# EAGLE design M4-Shim-1 (EAGLE 7.7.0)
COMPANY: ADAFRUIT INDUSTRIES; DRAWN: KTOWN; REV: B
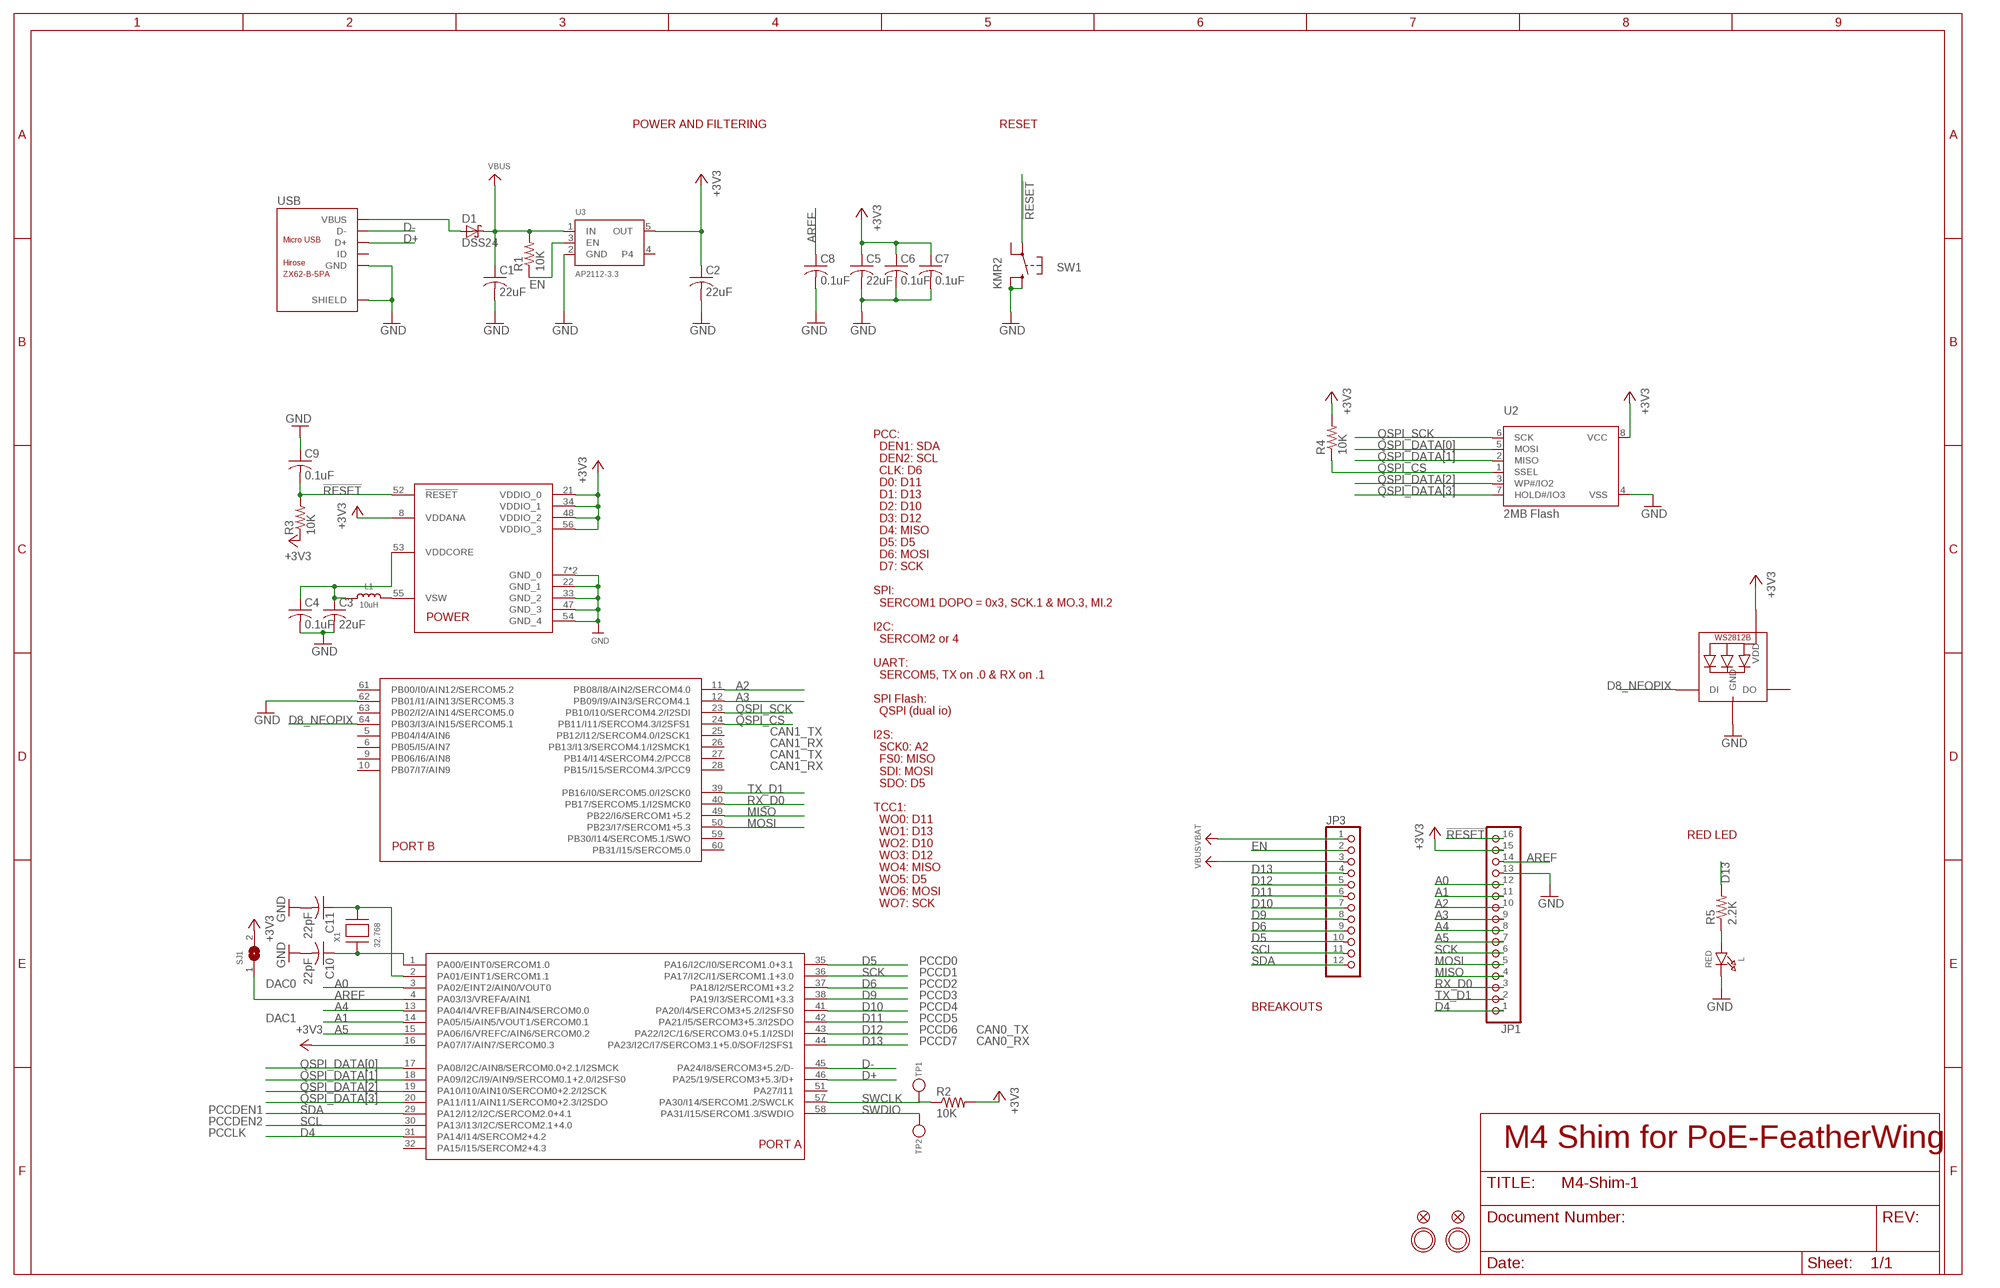
[diagram p0: schematic, sheet 1]

## Parts
C1  22uF  C-USC0805K  [C0805K]
C2  22uF  C-USC0805K  [C0805K]
C3  22uF  C-USC0805K  [C0805K]
C4  0.1uF  C-USC0402K  [C0402K]
C5  22uF  C-USC0805K  [C0805K]
C6  0.1uF  C-USC0402K  [C0402K]
C7  0.1uF  C-USC0402K  [C0402K]
C8  0.1uF  C-USC0402K  [C0402K]
C9  0.1uF  C-USC0402K  [C0402K]
C10  22pF  C-USC0402K  [C0402K]
C11  22pF  C-USC0402K  [C0402K]
D1  DSS24  [SOD123FL]
JP1  HEADER-1X16ROUND  [1X16_ROUND]
JP3  HEADER-1X12  [1X12_ROUND]
L  RED  LED0805_NOOUTLINE  [CHIPLED_0805_NOOUTLINE]
L1  10uH  INDUCTOR  [INDUCTOR_1007]
LED1  WS2812B3535  [LED3535]
R1  10K  R-US_R0402  [R0402]
R2  10K  R-US_R0402  [R0402]
R3  10K  R-US_R0402  [R0402]
R4  10K  R-US_R0402  [R0402]
R5  2.2K  R-US_R0402  [R0402]
SJ1  SOLDERJUMPERCLOSED  [SOLDERJUMPER_CLOSEDWIRE]
SW1  KMR2  SWITCH_TACT_SMT4.6X2.8  [BTN_KMR2_4.6X2.8]
TP1  TESTPOINTROUND1.5MM  [TESTPOINT_ROUND_1.5MM]
TP2  TESTPOINTROUND1.5MM  [TESTPOINT_ROUND_1.5MM]
U1  ATSAMD51J  [PQFN64-1]
U2  2MB Flash  SPIFLASH_8PINUX  [USON8]
U3  AP2112-3.3  VREG_SOT23-5  [SOT23-5]
U$31  MOUNTINGHOLE2.5  [MOUNTINGHOLE_2.5_PLATED]
U$32  MOUNTINGHOLE2.5  [MOUNTINGHOLE_2.5_PLATED]
U$34  FIDUCIAL_1MM  [FIDUCIAL_1MM]
U$35  FIDUCIAL_1MM  [FIDUCIAL_1MM]
USB  ZX62-B-5PA  MICRO-USB-SMD(ZX62-B-5PA)  [MICRO-USB5+6P-SMD-0.65-AB]
X1  32.768  XTAL-3.2X1.5  [XTAL3215]

## Nets
!RESET: C9.2 JP1.16 R3.2 SW1.A(P) U1.52(!RESET)
+3V3 [power]: C2.1 C5.1 C6.1 C7.1 JP1.15 LED1.2(VDD) R2.2 R3.1 R4.2 SJ1.2 U1.8(VDDANA) U1.16(PA07/I7/AIN7/SERCOM0.3) U1.21(VDDIO_0) U1.34(VDDIO_1) U1.48(VDDIO_2) U1.56(VDDIO_3) U2.8(VCC) U3.5(OUT)
A0: JP1.12 U1.3(PA02/EINT2/AIN0/VOUT0)
A1: JP1.11 U1.14(PA05/I5/AIN5/VOUT1/SERCOM0.1)
A2: JP1.10 U1.11(PB08/I8/AIN2/SERCOM4.0)
A3: JP1.9 U1.12(PB09/I9/AIN3/SERCOM4.1)
A4: JP1.8 U1.13(PA04/I4/VREFB/AIN4/SERCOM0.0)
A5: JP1.7 U1.15(PA06/I6/VREFC/AIN6/SERCOM0.2)
AREF: C8.1 JP1.14 SJ1.1 U1.4(PA03/I3/VREFA/AIN1)
D4: JP1.1 U1.31(PA14/I14/SERCOM2+4.2)
D5: JP3.10 U1.35(PA16/I2C/I0/SERCOM1.0+3.1)
D6: JP3.9 U1.37(PA18/I2/SERCOM1+3.2)
D8_NEOPIX: LED1.1(DI) U1.64(PB03/I3/AIN15/SERCOM5.1)
D9: JP3.8 U1.38(PA19/I3/SERCOM1+3.3)
D10: JP3.7 U1.41(PA20/I4/SERCOM3+5.2/I2SFS0)
D11: JP3.6 U1.42(PA21/I5/SERCOM3+5.3/I2SDO)
D12: JP3.5 U1.43(PA22/I2C/16/SERCOM3.0+5.1/I2SDI)
D13: JP3.4 R5.2 U1.44(PA23/I2C/I7/SERCOM3.1+5.0/SOF/I2SFS1)
D+: U1.46(PA25/19/SERCOM3+5.3/D+) USB.3(D+)
D-: U1.45(PA24/I8/SERCOM3+5.2/D-) USB.2(D-)
EN: JP3.2 R1.1 U3.3(EN)
GND [gnd]: C1.2 C2.2 C3.2 C4.2 C5.2 C6.2 C7.2 C8.2 C9.1 C10.2 C11.2 JP1.13 L.C LED1.4(GND) SW1.B'(S1) SW1.B(S) U1.7(GND_0) U1.22(GND_1) U1.33(GND_2) U1.47(GND_3) U1.54(GND_4) U1.62(PB01/I1/AIN13/SERCOM5.3) U1.EXP(GND_0) U2.4(VSS) U3.2(GND) USB.5(GND) USB.P1(SHIELD) USB.P2(SHIELD) USB.P3(SHIELD) USB.P4(SHIELD) USB.P5(SHIELD) USB.P6(SHIELD)
MISO: JP1.4 U1.49(PB22/I6/SERCOM1+5.2)
MOSI: JP1.5 U1.50(PB23/I7/SERCOM1+5.3)
N$2: L.A R5.1
N$5: C10.1 U1.1(PA00/EINT0/SERCOM1.0) X1.P$1
N$7: C11.1 U1.2(PA01/EINT1/SERCOM1.1) X1.P$2
N$11: L1.P$2 U1.55(VSW)
QSPI_CS: R4.1 U1.24(PB11/I11/SERCOM4.3/I2SFS1) U2.1(SSEL)
QSPI_DATA[0]: U1.17(PA08/I2C/AIN8/SERCOM0.0+2.1/I2SMCK) U2.5(MOSI)
QSPI_DATA[1]: U1.18(PA09/I2C/I9/AIN9/SERCOM0.1+2.0/I2SFS0) U2.2(MISO)
QSPI_DATA[2]: U1.19(PA10/I10/AIN10/SERCOM0+2.2/I2SCK) U2.3(WP#/IO2)
QSPI_DATA[3]: U1.20(PA11/I11/AIN11/SERCOM0+2.3/I2SDO) U2.7(HOLD#/IO3)
QSPI_SCK: U1.23(PB10/I10/SERCOM4.2/I2SDI) U2.6(SCK)
RX_D0: JP1.3 U1.40(PB17/SERCOM5.1/I2SMCK0)
SCK: JP1.6 U1.36(PA17/I2C/I1/SERCOM1.1+3.0)
SCL: JP3.11 U1.30(PA13/I13/I2C/SERCOM2.1+4.0)
SDA: JP3.12 U1.29(PA12/I12/I2C/SERCOM2.0+4.1)
SWCLK: R2.1 TP1.P$1 U1.57(PA30/I14/SERCOM1.2/SWCLK)
SWDIO: TP2.P$1 U1.58(PA31/I15/SERCOM1.3/SWDIO)
TX_D1: JP1.2 U1.39(PB16/I0/SERCOM5.0/I2SCK0)
VBAT [power]: JP3.1
VBUS [power]: C1.1 D1.C JP3.3 R1.2 U3.1(IN)
VBUSEXT [power]: D1.A USB.1(VBUS)
VDDCORE1: C3.1 C4.1 L1.P$1 U1.53(VDDCORE)
Unconnected: LED1.3(DO) SW1.A'(P1) U1.5(PB04/I4/AIN6) U1.6(PB05/I5/AIN7) U1.9(PB06/I6/AIN8) U1.10(PB07/I7/AIN9) U1.25(PB12/I12/SERCOM4.0/I2SCK1) U1.26(PB13/I13/SERCOM4.1/I2SMCK1) U1.27(PB14/I14/SERCOM4.2/PCC8) U1.28(PB15/I15/SERCOM4.3/PCC9) U1.32(PA15/I15/SERCOM2+4.3) U1.51(PA27/I11) U1.59(PB30/I14/SERCOM5.1/SWO) U1.60(PB31/I15/SERCOM5.0) U1.61(PB00/I0/AIN12/SERCOM5.2) U1.63(PB02/I2/AIN14/SERCOM5.0) U3.4 USB.4(ID)

## Notes on the sheet
- POWER AND FILTERING | RESET
- CAN1_TX
- CAN1_RX
- CAN1_TX
- CAN1_RX
- RED LED
- PCC:
    DEN1: SDA
    DEN2: SCL
    CLK: D6
    D0: D11
    D1: D13
    D2: D10
    D3: D12
    D4: MISO
    D5: D5
    D6: MOSI
    D7: SCK
  
  SPI:
    SERCOM1 DOPO = 0x3, SCK.1 & MO.3, MI.2
  
  I2C:
    SERCOM2 or 4
  
  UART:
    SERCOM5, TX on .0 & RX on .1
  
  SPI Flash:
    QSPI (dual io)
  
  I2S:
    SCK0: A2
    FS0: MISO
    SDI: MOSI
    SDO: D5
  
  TCC1:
    WO0: D11
    WO1: D13
    WO2: D10
    WO3: D12
    WO4: MISO
    WO5: D5
    WO6: MOSI
    WO7: SCK
- PCCD0
- PCCD1
- DAC0 | PCCD2
- PCCD3
- PCCD4 | BREAKOUTS
- DAC1 | PCCD5
- PCCD6 | CAN0_TX
- PCCD7 | CAN0_RX
- PCCDEN1
- PCCDEN2
- PCCLK
- M4 Shim for PoE-FeatherWing

## Library data of the parts
C1-C11 = rcl:C-US: CAPACITOR, American symbol
D1 = LiFePO4wered-ESP32:DSS24: DSS22-DSS225 https://datasheet.lcsc.com/szlcsc/DIYI-Elec-Tech-D24_C150988.pdf
JP1 = microbuilder:HEADER-1X16: PIN HEADER
JP3 = microbuilder:HEADER-1X12
L = microbuilder:LED: LED 0603 - 0603 Surface Mount Package 2mA: Green LED - Low Power (3.9mcd, 2ma, 1.7Vf) - Digikey: 475-2709-2-ND Orange LED - Low Power (9.8mcd, 2ma, 1.8Vf) - Digikey: 475-1194-2-ND Red LED - Low Power (5mcd, 2ma, 1.8Vf) - Digikey: 475-1195-2-ND Yellow LED - Low Power (7mcd, 2ma, 1.8Vf) - Digikey: 475-1196-2-ND 5mA: Blue LED - Low Power (17mcd, 5ma, 2.9Vf) - Digikey: LNJ937W8CRACT-ND 0805 - 0805 Surface Mount Package 2mA: Red LED (8.8mcd, 2mA, 1.8Vf, Clear) - Low Power [Digikey: 475-2510-1-ND] Green LED (5mcd, 2mA, 1.8Vf, Clear) - Low Power [Digikey: 475-2730-1-ND] Yellow LED (11.3mcd, 2mA, 1.8Vf, Clear) - Low Power [Digikey: 475-2555-1-ND] 20mA: Red LED (104mcd, 20mA, Diffused) - LS R976 [Digikey: 475-1278-6-ND] Red LED (12mcd, 20mA, 2.0Vf, Clear) - APT2012EC [Digikey: 754-1128-1-ND] Green LED (15mcd, 20mA, 2.2Vf, Clear) - APT2012GC [Digikey: 754-1131-1-ND] Orange LED (160mcd, 20mA, 2.1Vf, Clear) - APT2012SECK [Digikey: 754-1130-1-ND] 1206 - 1206 Surface Mount Package Green LED (26mcd, 20mA, Diffused) - LG N971 [Digikey: 475-1407-6-ND] Red LED (15mcd, 20mA, Diffused) - LH N974 [Digikey: 475-1416-6-ND] Cree - Cree High-Power Surface Mount LEDs XPEBWT-L1-0000-00D50 - White 111lm 350mA 2.9Vf 6200K 110° XTEAWT-00-0000-00000LEE3 - White 114lm 350mA 2.85Vf 5000K 115° Everlight - Everlight 45-21 Series Surface Mount LEDs 45-21/QK2C-B2832AC2CB2/2T - Warm White 2000mcd 20mA 3.25Vf 3050K 120° 45-21/LK2C-B38452C4CB2/2T - Nuetral White 2000mcd 20mA 3.25Vf 4150K 120° 45-21/LK2C-B50634C6CB2/2T - Cold White 2200mcd 20mA 3.25Vf 5650K 120° PLCC2 Reverse Mount LS T77K-J1L2-1-0-2-R18-Z - Red 11.25mcd 2mA 1.8Vf 630nm 120° LO T77K-L1M2-24-Z - Orange 19.6mcd 2mA 1.8Vf 606nm 120° LY T77K-K2M1-26-Z - Yellow 15.7mcd 2mA 1.8Vf 587nm 120°
L1 = microbuilder:INDUCTOR: Inductors 0603: 10nH Ceramic Inductor - microwire antenna/RF (Digikey: 712-1434-2-ND) 0805: 560nH Ceramic Inductor - RF (Digikey: 553-1047-1-ND) 270nH Ceramic Inductor - Q = 40@250MHz, +-5%, 1 Ohm DC Resistance (Digikey: 535-10506-2-ND) 1007 (2518 Metric) SMT: 10µH 10% 250mOhm 820mA 1007 Inductor (Digikey: 587-2189-1-ND) 22µH 10% 500mOhm 580mA 1007 Inductor (Digikey: 587-2190-1-ND) 47µH 10% 950mOhm 420mA 1007 Inductor (Digikey: 587-2191-1-ND) 47µH 5% 100mOhm 1A 1008 Inductor (Digikey: 732-1816-1-ND) 5.0x5.0mm (Taiyo Yuden NR5040 Series) 6.8µH 20% 2.3A 64mOhm Inductor (Digikey: 587-2374-2-ND) 5.0x5.0mm (TDK VLC5045 Series) 4.7µH 20% 3.3A 34mOhm Inductor (Digikey: 445-6526-1-ND) 6.8µH 20% 2.7A 46mOhm Inductor (Digikey: 445-6527-1-ND) 6.0x6.0mm (TDK VLC6045 Series) 4.7µH 20% 3.8A 27mOhm Inductor (Digikey: 445-6538-2-ND) 6.8µH 20% 3A 41mOhm Inductor (Digikey: 445-6540-1-ND) 6.2µH 30% 2.2A 45mOhm Inductor (Digikey: SRR5028-6R2YCT-ND) - Not TDK VLC6045 but footprint should match 6.0x6.0mm (TDK SLF6045 Series) 6.8uH 30% 2A 33mOhm Inductor (Digikey: 445-4572-1-ND, Mouser: 810-SLF645T6R8N2R0PF) 6.0x6.0mm (Sumida CDRH5D28 Series) 6.2uH 30% 1.8A 45mOhm Inductor (Digikey: 308-1542-1-ND) Taiyo Yuden NR3015T2R2M - 2.2uH 20% 1.5A (Digikey: 587-1648-2-ND, Mouser: 963-NR3015T2R2M) - Used with TI TPS62172 CoilCraft RFID Transponder Coil - MA5532-AE (For use with AS3935 Lightning Sensor) Taiyo Yuden NRH2412T2R2MNGH - 2.2uH 20% 1AA (Digikey: 587-3443-1-ND) - Used with TI LM3671 Vishay IHLP 1.0uH Molded Inductor - 24mOhm DCR, 5A, +/-20%, -55°C-125°C (Digikey: 541-1319-1-ND)
LED1 = microbuilder:WS2812B
R1-R5 = rcl:R-US_: RESISTOR, American symbol
SJ1 = microbuilder:SOLDERJUMPER: SMD Solder JUMPER Solder the two pads together to create a connection, or remove the solder to break it. REFLOW - Use this footprint for solder paste and reflow ovens. WAVE - Use this footprint for hand-soldering (larger pads). CLOSED - Has a trace between the two pads to ensure it is closed by default. The trace needs to be cut to disable the jumper, and can be closed again by creating a solder bridge between the two pads.
SW1 = microbuilder:SWITCH_TACT_SMT: SMT Tact Switches 6x6mm - Digikey: P12940SCT-ND KMR2 (4.6x2.8mm) - Digikey: 401-1426-1-ND EVQ-PQHB55 - Light Touch, 160GF (4.5x4.5mm) - Digikey: P8090SCT-ND KMT0 - KMT021 NGJ LHS (etc.) IP68/Waterproof - Digikey: CKN10289CT-ND
TP1 TP2 = microbuilder:TESTPOINT: Test Point Various test points for characterisation and PCB testing TESTPOINT_SMT - Compact Surface Mount Test Point [Digikey: 5016KTR-ND]
U1 = microbuilder:ATSAMD51J: ATSAMD51J cortex m4 microcontroller
U2 = microbuilder:SPIFLASH_8PIN: SOIC8 SPI Flash Be careful with the size since SOIC8 flash comes in several 'widths' SOIC8 150 mil M25P16 - 16Mbit (2Mbit x 8) Serial Flash (75MHz SPI Bus), Supply: 2.7-3.6V Digikey: SOIC8 - M25P16-VMN6P-ND SOIC8 208 mil W25Q16BVSSIG - 16Mbit (2Mbit x 8) Serial Flash (104MHz SPI Bus), Supply: 2.7-3.6V Digikey: SOIC8 - W25Q16BVSSIG-ND
U3 = microbuilder:VREG_SOT23-5: SOT23-5 Fixed Voltage Regulators Part Current Out V Out V In V Dropout θJA (°C/W) TJ (°C) Digikey Part No. ADP121 150mA 3.3V 3.4-5.5V 0.09V @ 150mA -- -- ADP121-AUJZ33R7CT-ND ADP121 150mA 3.0V 3.1-5.5V 0.09V @ 150mA -- -- ADP121-AUJZ30R7CT-ND ADP122 300mA 3.3V 3.4-5.5V 0.085V @ 300mA -- -- ADP122AUJZ-3.3-R7CT-ND ADP1712 300mA 3.3V 3.5-5.5V 0.17V @ 300mA -- -- ADP1712AUJZ-3.3-R7TR-ND AP7311 (Low Cost) 150mA 3.3V 3.5-6V 0.15V @ 150mA -- -- AP7311-33WG-7DICT-ND LD39015M18R 150mA 1.8V 1.9V-5.5V 0.08V @ 100mA -- -- 497-6977-1-ND LP2985A-33DBVR 150mA 3.3V 3.3-16V 0.28V @ 150mA 206 150 296-18479-1-ND MCP1824T-3302E/OT 300mA 3.3V 3.5V-6V 0.2V @ 300mA -- -- MCP1824T-3302E/OTCT-ND MIC5205-2.5YM5 TR 150mA 2.5V 2.7-16V 0.165V @ 150mA -- -- 576-1257-2-ND MIC5205-3.0YM5 TR 150mA 3.0V 3.2V-16V 0.165V @ 150mA -- -- 576-1258-2-ND MIC5205-3.3YM5 TR 150mA 3.3V 3.5V-16V 0.165V @ 150mA -- -- 576-1259-2-ND TPS780330220 150mA 3.3V+2.2V 3.6-5.5V 250mV Max -- -- 296-23332-1-ND TDA3663/N1,135 100mA 3.3V 3.5-45V 0.18V @ 50mA -- -- 568-5343-1-ND Max operating temp can be calculated using θJA, TJ (max junction temperature), and power in watts. Set the "Maximum Ambient Temperature" until it reaches TJ ("Max Junction Temperature"), which is the absolute limit for safe use of the regulator: Heat Sink Temperature Calculator <http://www.daycounter.com/Calculators/Heat-Sink-Temperature-Calculator.phtml> For example, With 12V source into a 3.3V LP2985 and a 30mA load, we are dissipating (12V-3.3V) * 0.03A = 0.261W. With a θJA of 206 °C/W, a TJ of 150°C, and 261mW we can safely use the chip without a heat sink up to 75°C (=147.1°C Junction Temperature).
U$31 U$32 = microbuilder:MOUNTINGHOLE: Mounting Hole For #2 screws (0.086"/2.18mm width, 0.094"/2.4mm hole) use 2.5mm; BOM: EXCLUDE
U$34 U$35 = microbuilder:FIDUCIAL: Fiducial Alignment Points Various fiducial points for machine vision alignment.; BOM: EXCLUDE
USB = Seeed-OPL-Connector:MICRO-USB-SMD(ZX62-B-5PA): 320010005; MPN: ZX62-B-5PA
X1 = adafruit2:XTAL: Low cost SMT crystals, no capacitors included http://www.ladyada.net/library/eagle

## Net classes
1 power: width 0.305 mm
2 gnd: width 0.254 mm

## Board
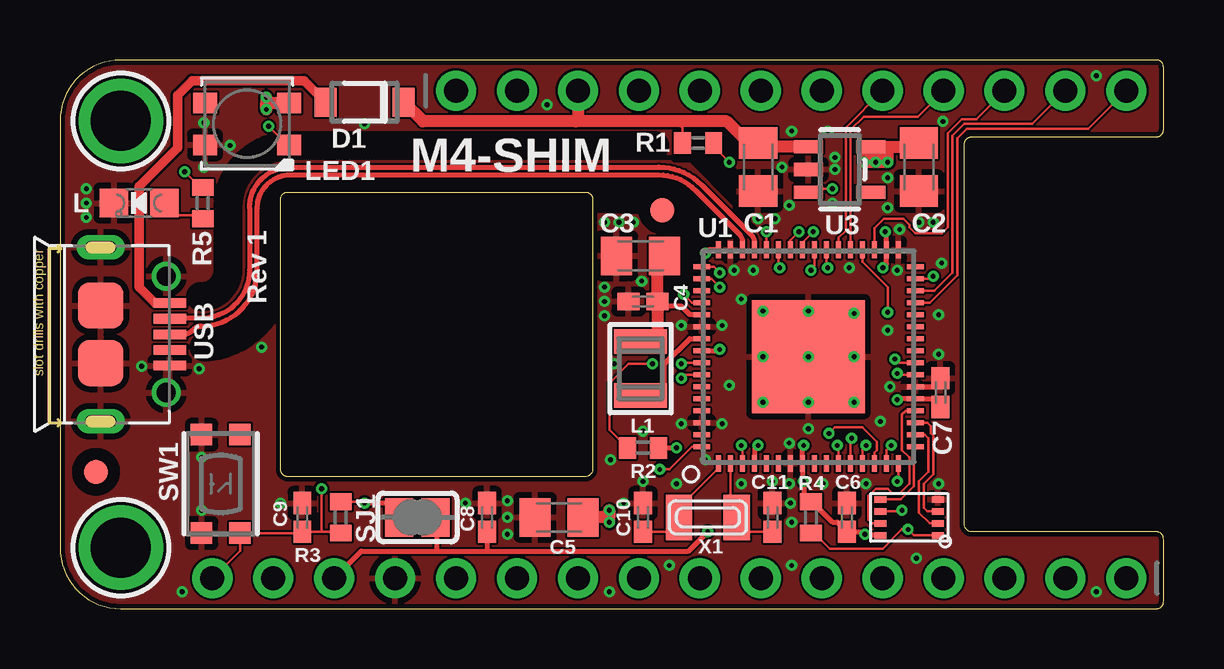
[diagram p1: board, top side]
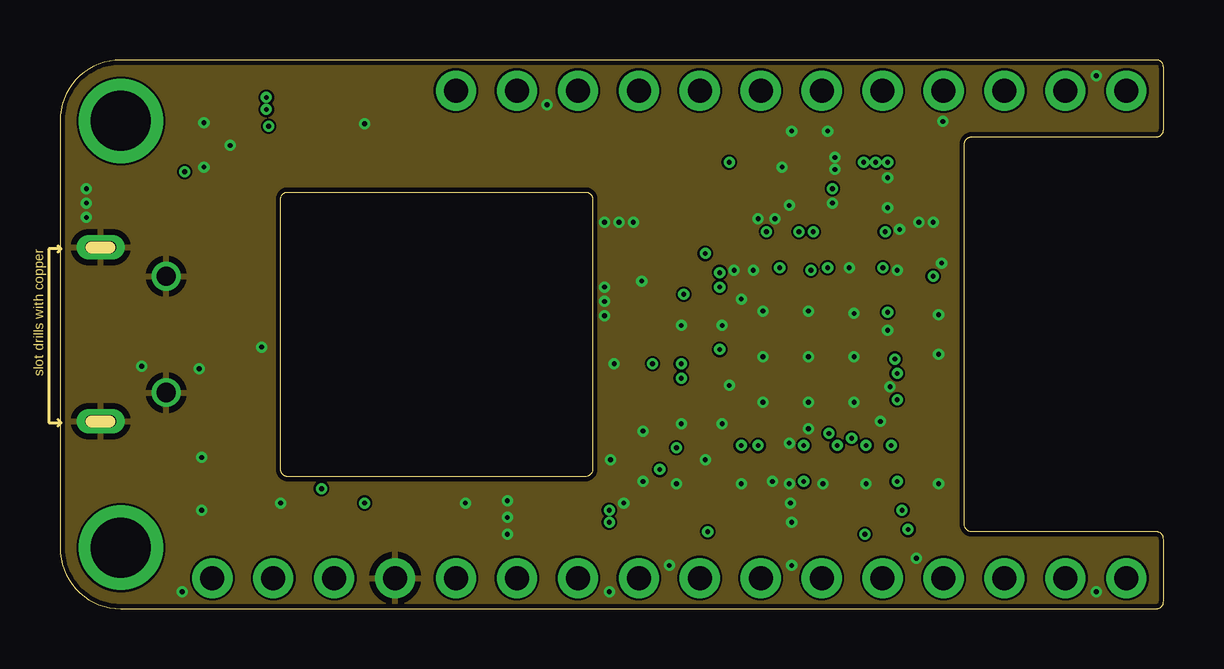
[diagram p2: board, inner layer Route2]
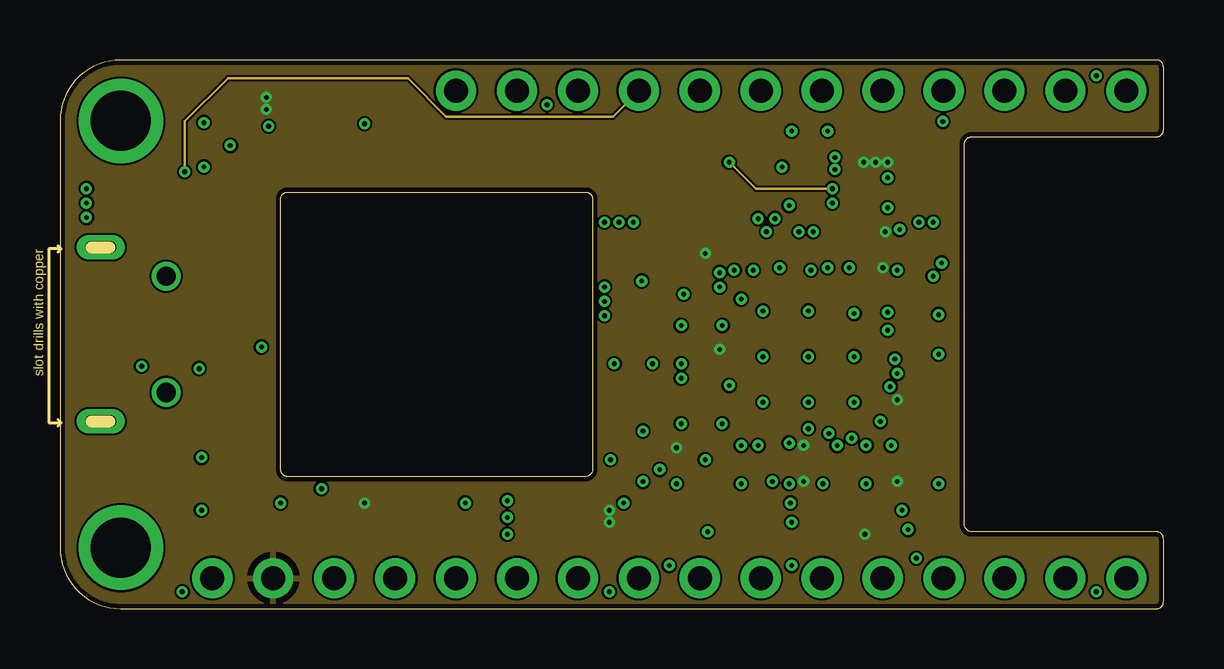
[diagram p3: board, inner layer Route3]
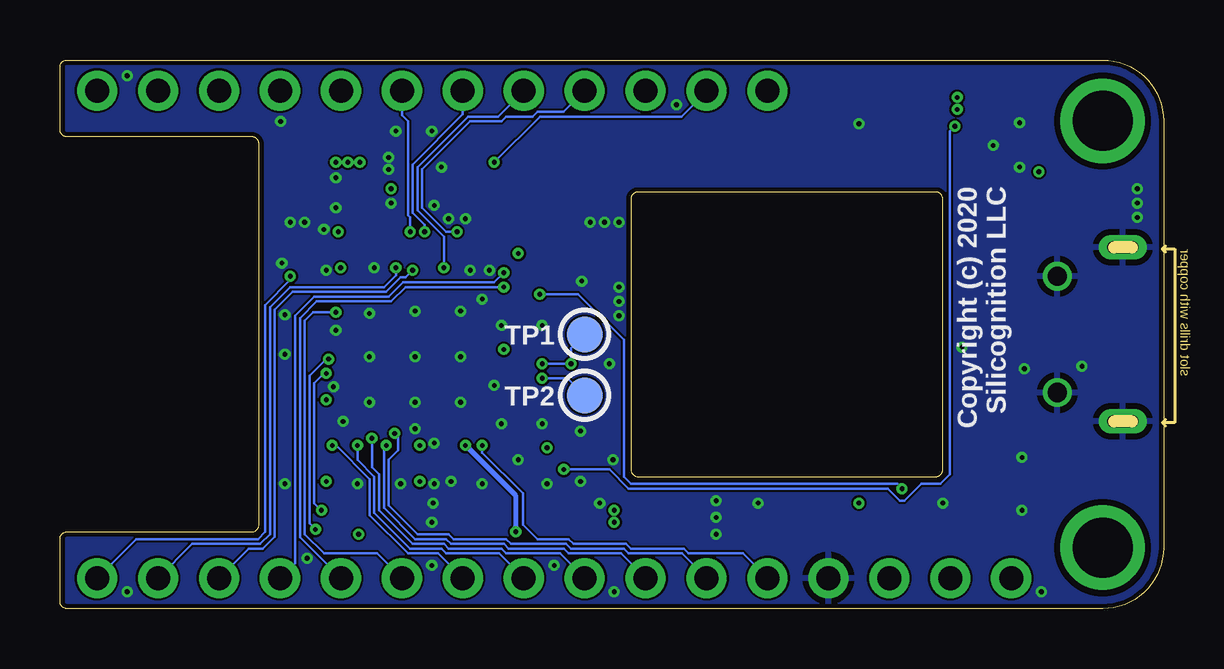
[diagram p4: board, bottom side, seen from below]

Size 46 x 22.86 mm. Coordinates in mm from the lower left corner, seen from the top.
Outline: 45.7,22.86 2.54,22.86 arc90 0,20.32 0,2.54 arc90 2.54,0 45.7,0 arc90 46,0.3 46,2.9 arc90 45.7,3.2 38,3.2 arc-90 37.7,3.5 37.7,19.36 arc-90 38,19.66 45.7,19.66 arc90 46,19.96 46,22.56 arc90 45.7,22.86
Outline: 21.9,5.5 9.5,5.5 arc-90 9.2,5.8 9.2,17.06 arc-90 9.5,17.36 21.9,17.36 arc-90 22.2,17.06 22.2,5.8 arc-90 21.9,5.5
Copper layers (1+2*3+16): Top 0.035mm / dielectric 0.24mm / Route2 0.017mm / dielectric 1mm / Route3 0.017mm / dielectric 0.24mm / Bottom 0.035mm
Design rules "default-4-layer": minimum track width 3.5mil, minimum drill 0.2mm, track to track 3.5mil, track to pad 5mil, pad to pad 5mil, via to via 5mil, smd to smd 3.5mil, copper to edge 0.2mm, drill to drill 0.1mm, minimum pad ring 3mil, minimum via ring 0.13mm, stop-mask expansion 4mil, vias tented up to drill 20mil, thermal gap 10mil
tRestrict: 19 lines

### Footprints (pad centres in the part's own frame; a part is rotated, then mirrored left to right if it is on the bottom)
C0805K = smd 1.3 x 1.6: 1 -1,0; 2 1,0
C0402K = smd 0.925 x 0.74: 1 -0.6,0; 2 0.6,0
SOD123FL = smd 0.91 x 1.22: A 1.625,0; C -1.625,0
1X16_ROUND = drill 1 pad 1.676: 1 -19.05,0; 2 -16.51,0; 3 -13.97,0; 4 -11.43,0; 5 -8.89,0; 6 -6.35,0; 7 -3.81,0; 8 -1.27,0; 9 1.27,0; 10 3.81,0; 11 6.35,0; 12 8.89,0; 13 11.43,0; 14 13.97,0; 15 16.51,0; 16 19.05,0
1X12_ROUND = drill 1 pad 1.676: 1 -13.97,0; 2 -11.43,0; 3 -8.89,0; 4 -6.35,0; 5 -3.81,0; 6 -1.27,0; 7 1.27,0; 8 3.81,0; 9 6.35,0; 10 8.89,0; 11 11.43,0; 12 13.97,0
CHIPLED_0805_NOOUTLINE = smd 1.2 x 1.2: A 0,-1.05; C 0,1.05
INDUCTOR_1007 = smd 1.016 x 2.2: P$1 -1.127,0; P$2 1.127,0
LED3535 = smd 1 x 0.85: 1 -1.75,0.875; 2 -1.75,-0.875; 3 1.75,-0.875; 4 1.75,0.875
R0402 = smd 0.7 x 0.9: 1 -0.65,0; 2 0.65,0
SOLDERJUMPER_CLOSEDWIRE = smd 1.168 x 1.6: 1 -0.762,0; 2 0.762,0 | smd 0.635 x 0.203: WIRE 0,0
BTN_KMR2_4.6X2.8 = smd 0.9 x 0.9: A 2.05,0.8; A' -2.05,0.8; B 2.05,-0.8; B' -2.05,-0.8
TESTPOINT_ROUND_1.5MM = smd 1.5 x 1.5: P$1 0,0
PQFN64-1 = smd 0.7 x 0.22: 1 -4.45,3.75; 2 -4.45,3.25; 3 -4.45,2.75; 4 -4.45,2.25; 5 -4.45,1.75; 6 -4.45,1.25; 7 -4.45,0.75; 8 -4.45,0.25; 9 -4.45,-0.25; 10 -4.45,-0.75; 11 -4.45,-1.25; 12 -4.45,-1.75; 13 -4.45,-2.25; 14 -4.45,-2.75; 15 -4.45,-3.25; 16 -4.45,-3.75; 33 4.45,-3.75; 34 4.45,-3.25; 35 4.45,-2.75; 36 4.45,-2.25; 37 4.45,-1.75; 38 4.45,-1.25; 39 4.45,-0.75; 40 4.45,-0.25; 41 4.45,0.25; 42 4.45,0.75; 43 4.45,1.25; 44 4.45,1.75; 45 4.45,2.25; 46 4.45,2.75; 47 4.45,3.25; 48 4.45,3.75 | smd 0.22 x 0.7: 17 -3.75,-4.45; 18 -3.25,-4.45; 19 -2.75,-4.45; 20 -2.25,-4.45; 21 -1.75,-4.45; 22 -1.25,-4.45; 23 -0.75,-4.45; 24 -0.25,-4.45; 25 0.25,-4.45; 26 0.75,-4.45; 27 1.25,-4.45; 28 1.75,-4.45; 29 2.25,-4.45; 30 2.75,-4.45; 31 3.25,-4.45; 32 3.75,-4.45; 49 3.75,4.45; 50 3.25,4.45; 51 2.75,4.45; 52 2.25,4.45; 53 1.75,4.45; 54 1.25,4.45; 55 0.75,4.45; 56 0.25,4.45; 57 -0.25,4.45; 58 -0.75,4.45; 59 -1.25,4.45; 60 -1.75,4.45; 61 -2.25,4.45; 62 -2.75,4.45; 63 -3.25,4.45; 64 -3.75,4.45 | smd 4.7 x 4.7: EXP 0,0
USON8 = smd 0.5 x 0.275: 1 -1.2,0.75; 2 -1.2,0.25; 3 -1.2,-0.25; 4 -1.2,-0.75; 5 1.2,-0.75; 6 1.2,-0.25; 7 1.2,0.25; 8 1.2,0.75
SOT23-5 = smd 0.55 x 1.2: 1 -0.95,-1.3; 2 0,-1.3; 3 0.95,-1.3; 4 0.95,1.3; 5 -0.95,1.3
MOUNTINGHOLE_2.5_PLATED = drill 2.5 pad 3.2: P$1 0,0
FIDUCIAL_1MM = smd 1 x 1: 1 0,0
MICRO-USB5+6P-SMD-0.65-AB = smd 0.4 x 1.35: 1 -1.3,2.875; 2 -0.65,2.875; 3 0,2.875; 4 0.65,2.875; 5 1.3,2.875 | smd 1.9 x 1.9: P1 -1.2,0; P2 1.2,0 | drill 0.508 pad 1.016 long: P3 -3.625,0; P4 3.625,0 | drill 0.8: P5 -2.425,2.73; P6 2.425,2.73
XTAL3215 = smd 1.1 x 1.9: P$1 1.2,0; P$2 -1.2,0

### Placement (x,y rotation side)
C1  29.1,18.4 270 top
C2  35.8,18.4 270 top
C3  24.2,14.7 180 top
C4  24.3,12.8 180 top
C5  20.8,3.8 180 top
C6  32.8,3.8 90 top
C7  36.7,9 90 top
C8  17.8,3.8 90 top
C9  10.1,3.8 270 top
C10  24.3,3.8 90 top
C11  29.7,3.8 90 top
D1  12.7,21.1 180 top
JP1  25.4,1.27 180 top
JP3  30.48,21.58 0 top
L  3.3,16.9 90 top
L1  24.2,10 270 top
LED1  7.8,20.2 180 top
R1  26.6,19.4 180 top
R2  24.3,6.7 0 top
R3  11.7,3.8 270 top
R4  31.3,3.8 90 top
R5  5.95,16.9 90 top
SJ1  14.9,3.8 180 top
SW1  6.7,5.2 270 top
TP1  24.13,11.43 0 bottom
TP2  24.13,8.89 0 bottom
U1  31.2,10.5 90 top
U2  35.4,3.8 180 top
U3  32.5,18.3 270 top
U$31  2.54,20.32 0 top
U$32  2.54,2.54 0 top
U$34  25.11,16.6 0 top
U$35  1.5,5.7 0 top
USB  1.7,11.43 270 top
X1  27,3.8 180 top

### Tracks (layer width: path | path; a pad name or v marks a point on that pad's centre or on a via)
!RESET  (via drill 0.2)
  Top 0.1: JP1.16 7.5,2.42 SW1.A 10.05,3.15 C9.2 10.9,3.2 | 10.9,3.2 11.65,3.2 R3.2 | U1.52 26.35,12.75 v26,13.1 | v10.9,5 10.9,3.2
  Bottom 0.1: v26,13.1 24.4,13.1 22.5,11.2 22.5,5.5 22.2,5.2 11.1,5.2 v10.9,5
+3V3  (via drill 0.2)
  Top 0.1: v34.9,5.3 34.95,5.35 U1.16 | R3.1 12.65,4.45 v12.7,4.4
  Top 0.2: v34.9,8.7 34.95,8.75 U1.21 36.35,8.75 C7.1 | v31,6.8 30.95,6.75 U1.8 30.95,5.35 v31,5.3 31,4.6 31.2,4.6 31.3,4.5 | U1.56 27.45,10.75 v27.5,10.8 | R2.2 v25.7,6.7 | v34.3,14.2 34.45,14.35 U1.34 34.45,15.65 v34.4,15.7 | U2.8 33.6,3.05 v33.55,3.1 33.45,3.2 C6.1 32.4,3.6 32.2,3.6 31.35,4.45 R4.2 | SJ1.2 14.14,3.86 13.6,4.4 v12.7,4.4 | U1.48 27.05,14.95 v26.9,14.8
  Top 0.5: C2.1 35.65,19.25 U3.5 34,19.05 v34,18.6 | 33.5,19.2 v33.5,18.6 v34.5,18.6 34.5,19.2 | v8.6,21.3 v8.6,20.8 8.6,21.07 LED1.2 | v22.9,3.6 22.9,3.8 | v22.9,4.1 22.9,3.8 | 22.9,3.8 C5.1
  pour Route3: 0,0 46,0 46,22.9 0,22.9
A0  (via drill 0.2)
  Top 0.1: U1.3 28.45,6.75 v28.4,6.8
  Bottom 0.1: v28.4,6.8 28.4,6.5 26.7,4.8 26.7,3.5 26.1,2.9 24.8,2.9 24.6,2.7 22.4,2.7 22.2,2.5 20,2.5 19.8,2.3 17.54,2.3 JP1.12
A1  (via drill 0.2)
  Top 0.1: U1.14 33.95,6.5 34.05,6.6 34.05,6.95 33.45,7.55 32.3,7.55 v32.05,7.3
  Bottom 0.1: v32.05,7.3 31.9,7.15 31.9,6.6 32.3,6.2 32.3,4.3 31.1,3.1 29.8,3.1 29.6,2.9 27.4,2.9 27.2,2.7 24.9,2.7 24.7,2.5 22.5,2.5 22.3,2.3 20.08,2.3 JP1.11
A2  (via drill 0.2)
  Top 0.1: U1.11 32.45,6.65 v32.4,6.8
  Bottom 0.1: v32.4,6.8 32.5,6.7 32.5,4.2 31.2,2.9 29.9,2.9 29.7,2.7 27.5,2.7 27.3,2.5 25,2.5 24.8,2.3 22.62,2.3 JP1.10
A3  (via drill 0.2)
  Top 0.1: U1.12 32.95,7.05 v33,7.1
  Bottom 0.1: v33,7.1 33,5.9 32.7,5.6 32.7,4.1 31.3,2.7 30,2.7 29.8,2.5 27.6,2.5 27.4,2.3 25.16,2.3 JP1.9
A4  (via drill 0.2)
  Top 0.1: U1.13 33.45,6.65 v33.6,6.8
  Bottom 0.1: JP1.8 27.7,2.3 29.9,2.3 30.1,2.5 31.4,2.5 32.9,4 32.9,5.5 33.6,6.2 v33.6,6.8
A5  (via drill 0.2)
  Top 0.1: U1.15 34.45,6.6 v34.65,6.8
  Bottom 0.1: v34.65,6.8 34.5,6.8 33.1,5.4 33.1,3.9 31.5,2.3 30.24,2.3 JP1.7
AREF  (via drill 0.2)
  Top 0.2: JP1.14 12.56,2.4 15.7,2.4 | 15.7,2.4 17.8,2.4 | 17.8,2.4 26.2,2.4 v27,3.2 | C8.1 17.8,2.4 | SJ1.1 15.7,3.76 15.7,2.4 | v29.1,6.8 28.95,6.65 U1.4
  Bottom 0.2: v27,3.2 27,4.7 v29.1,6.8
D4  (via drill 0.2)
  Top 0.1: U1.31 36.3,13.75 v36.4,13.85
  Bottom 0.1: JP1.1 42.82,2.9 37.75,2.9 37.45,3.2 37.45,12.65 36.4,13.7 v36.4,13.85
D5
  Top 0.1: U1.35 33.95,15.85 34.35,16.25 35.15,16.25 35.4,16 35.4,15.9 35.65,15.65 36.75,15.65 37,15.9 37,19.8 37.6,20.4 38.19,20.4 JP3.10
D6
  Top 0.1: U1.37 32.95,19.95 33.5,20.5 35.75,20.5 JP3.9
D8_NEOPIX  (via drill 0.2)
  Top 0.1: LED1.1 9.47,19.32 v8.7,20.1 | U1.64 26.35,6.75 25.4,5.8 v25,5.8
  Bottom 0.1: v8.7,20.1 8.9,19.9 8.9,5.6 9.3,5.2 10.1,5.2 10.8,4.5 11,4.5 11.5,5 22.3,5 23.1,5.8 v25,5.8
D9
  Top 0.1: U1.38 32.45,15.45 32.75,15.75 32.75,20.04 JP3.8
D10  (via drill 0.2)
  Top 0.1: U1.41 30.95,15.25 v31.4,15.7
  Bottom 0.1: v31.4,15.7 31.4,16.3 31.5,16.4 31.5,20.3 31.75,20.55 JP3.7
D11  (via drill 0.2)
  Top 0.1: U1.42 30.45,15.35 v30.8,15.7
  Bottom 0.1: JP3.6 29.21,20.59 31.3,18.5 31.3,16.5 30.8,16 v30.8,15.7
D12  (via drill 0.2)
  Top 0.1: U1.43 29.95,14.25 v30,14.2
  Bottom 0.1: v30,14.2 30,15.5 31.1,16.6 31.1,18.4 29,20.5 27.75,20.5 JP3.5
D13  (via drill 0.2)
  Top 0.1: v5.2,18.2 5.85,17.55 R5.2 | U1.44 v29.45,15.7
  Route3 0.1: JP3.4 23.05,20.5 16.1,20.5 14.5,22.1 7,22.1 5.2,20.3 v5.2,18.2
  Bottom 0.1: JP3.4 25.01,20.7 26.1,20.7 26.3,20.5 27.4,20.5 27.6,20.3 28.9,20.3 30.9,18.3 30.9,16.7 29.9,15.7 v29.45,15.7
D+
  Top 0.2: 28.45,15.35 U1.46 28.45,15.27 arc45 28.3,15.62 26.49,17.44 arc45 24.95,18.07 9.6,18.07 arc90 8.22,16.7 8.22,14.1 arc-90 5.9,11.78 arc45 5.56,11.63 5.5,11.58 arc-45 5.15,11.43 USB.3
D-
  Top 0.2: 4.59,12.1 5.9,12.1 arc90 7.9,14.1 7.9,16.7 arc-90 9.6,18.4 24.96,18.4 arc-45 26.73,17.67 28.8,15.6 arc-45 28.95,15.24 U1.45
  Top 0.35: 4.59,12.1 USB.2
EN  (via drill 0.2)
  Top 0.1: R1.1 27.5,19.15 27.5,19 v27.9,18.6 | U3.3 31.35,17.5 v32.2,17.5
  Route3 0.1: v27.9,18.6 29,17.5 v32.2,17.5
  Bottom 0.1: v27.9,18.6 26,20.5 20.1,20.5 19.05,21.55 JP3.2
GND  (via drill 0.2, 0.5)
  Top 0.2: U1.22 36.35,9.25 C7.2
  other vias: 9.2,4.4 22.7,13.4 22.7,12.8 22.7,12.2 23.3,16.1 22.7,16.1 23.9,16.1 24.25,13.65 25.9,11.8 27.6,11.8 30.4,6.9 30.4,5.2 28.1,14.1 35,15.8 34.9,14.1 34.6,9.25 36.62,10.6 36.62,5.2 34.5,17.95 34.5,16.7 32.3,18.3 35.8,16.1 29.3,12.4 33.1,12.3 29.3,8.6 33.1,8.6 29.3,10.5 33.1,10.5 31.2,12.4 31.2,10.5 31.2,8.6 7.1,19.3 6,20.25 6,18.4 1.1,16.9 1.1,17.5 1.1,16.3 30.1,18.4 30.4,16.8 5.8,10 3.4,10.1 29.1,16.25 29.8,16.25 36.4,16.1 31.8,5.2 33.6,5.2 5.9,6.3 5.9,4.1 23.1,10.2 16.9,4.4 18.65,3.8 18.65,4.5 18.65,3.1 24.3,7.4 25.9,7.7 27.6,7.7 32.2,16.9 32.3,18.8 30.45,4.4 29.7,5.3 28.4,5.2 25.7,5.2 24.3,5.3 23.5,4.4 36.62,12.25 36.75,14.4 30.5,19.9 36.8,20.3 32,19.9 28.9,14.1 28.4,12.9 32.9,14.2 34.5,11.6 34.2,7.8 31.2,7.5 27.9,9.3 26.9,6.2 22.95,6.2 30.5,3.6 12.7,20.2 20.3,21 43.2,22.2 5.1,0.7 22.9,0.7 43.2,0.7 35.7,2.1 30.5,1.8 25.4,1.8 8.4,10.9 1.7,15.05 1.7,7.8 1.8,7.8 1.9,7.8 2,7.8 2.1,7.8 1.6,7.8 1.5,7.8 1.4,7.8 1.3,7.8 1.8,15.05 1.9,15.05 2,15.05 2.1,15.05 1.6,15.05 1.5,15.05 1.4,15.05 1.4,15.05 1.3,15.05
  pour Top: 0,0 46,0 46,22.9 0,22.9
  pour Route2: 0,0 46,0 46,22.9 0,22.9
  pour Bottom: 0,0 46,0 46,22.9 0,22.9
MISO  (via drill 0.2)
  Top 0.1: v27.5,14 27.25,14.25 U1.49
  Bottom 0.1: JP1.4 36.2,1.9 36.2,12.2 35.4,13 32.3,13 31.7,13.6 27.9,13.6 v27.5,14
MOSI  (via drill 0.2)
  Top 0.1: v27.5,13.4 27.15,13.75 U1.50
  Bottom 0.1: JP1.5 36,2.98 36,12.1 35.3,12.8 32.2,12.8 31.6,13.4 v27.5,13.4
N$2
  Top 0.1: R5.1 5.8,16.4 4.8,16.4 4.35,16.85 L.A
N$5
  Top 0.1: X1.P$1 25.8,4.2 25.95,4.35 | 25.95,4.35 27.45,5.85 U1.1 | C10.1 25.95,3.2 25.95,4.35
N$7
  Top 0.1: U1.2 27.95,4.05 X1.P$2 28.2,3.2 C11.1
N$11
  Top 0.2: L1.P$2 24.87,8.87 25.2,9.2 25.2,10.2 26.25,11.25 U1.55
QSPI_CS  (via drill 0.2)
  Top 0.1: U2.1 35.6,3.05 v35.35,3.3 35.1,3.3 34.3,2.5 32.1,2.5 31.7,2.9 31.55,2.9 R4.1 | v34.8,10.4 34.95,10.25 U1.24
  Bottom 0.1: v35.35,3.3 35.6,3.55 35.6,9.7 34.9,10.4 v34.8,10.4
QSPI_DATA[0]
  Top 0.1: U2.5 35.05,4.55 35.6,5.1 35.6,6.7 U1.17
QSPI_DATA[1]
  Top 0.1: U1.18 36.05,7.25 36.2,7.1 36.2,5.7 35.8,5.3 35.8,4 36.25,3.55 U2.2
QSPI_DATA[2]
  Top 0.1: U1.19 36.15,7.75 36.3,7.6 36.3,7.3 36.4,7.2 36.4,5.6 36,5.2 36,4.2 36.15,4.05 U2.3
QSPI_DATA[3]
  Top 0.1: U1.20 35.25,8.25 35.1,8.1 35.1,6.6 35.4,6.3 35.4,5.2 35,4.8 34.7,4.8 34.5,5 34,5 33.7,4.7 33.7,3.7 33.85,3.55 U2.7
QSPI_SCK  (via drill 0.2)
  Top 0.1: U2.6 35.05,4.05 v35.1,4.1 | v34.9,9.8 34.95,9.75 U1.23
  Bottom 0.1: v35.1,4.1 35.4,4.4 35.4,9.4 35,9.8 v34.9,9.8
RX_D0  (via drill 0.2)
  Top 0.1: v31.3,14.1 31.45,14.25 U1.40
  Bottom 0.1: JP1.3 38.14,2.5 37.55,2.5 37.05,3 37.05,12.45 36.3,13.2 32.4,13.2 31.8,13.8 31.6,13.8 v31.3,14.1
SCK  (via drill 0.2)
  Top 0.1: v34.5,12.35 34.5,13.4 33.45,14.45 U1.36
  Bottom 0.1: JP1.6 32.78,2.3 35,2.3 35.8,3.1 35.8,12 35.45,12.35 v34.5,12.35
SCL
  Top 0.1: U1.30 36.45,13.25 37.2,14 37.2,19.7 37.7,20.2 40.53,20.2 JP3.11
SDA
  Top 0.1: U1.29 36.25,12.75 37.4,13.9 37.4,19.6 37.8,20 42.87,20 JP3.12
SWCLK  (via drill 0.2)
  Top 0.1: R2.1 22.9,7.45 22.9,9.4 23.7,10.2 v24.7,10.2 | U1.57 25.95,10.25 v25.9,10.2
  Bottom 0.1: v25.9,10.2 v24.7,10.2 24.7,10.86 TP1.P$1
SWDIO  (via drill 0.2)
  Top 0.1: v25.9,9.6 26.05,9.75 U1.58
  Bottom 0.1: TP2.P$1 24.84,9.6 v25.9,9.6
TX_D1  (via drill 0.2)
  Top 0.1: v32,14.2 31.95,14.25 U1.39
  Bottom 0.1: JP1.2 40.48,2.7 37.65,2.7 37.25,3.1 37.25,12.55 36.4,13.4 32.5,13.4 32,13.9 v32,14.2
VBUS
  Top 0.1: R1.2 25.95,20.3 25.9,20.3
  Top 0.5: U3.1 29.15,19.25 C1.1 28.8,19.3 27.8,20.3 25.9,20.3 21.5,20.3 | 21.5,20.3 15.12,20.3 D1.C | JP3.3 21.59,20.39 21.5,20.3
VBUSEXT
  Top 0.4: USB.1 3.97,12.73 3.3,13.4 3.3,17.6 4.9,19.2 4.9,21.4 5.5,22 10.18,22 D1.A
VDDCORE1
  Top 0.2: U1.53 26.25,12.25 25.9,12.6 25.1,12.6 C4.1
  Top 0.5: L1.P$1 24.9,11.03 C4.1 24.9,14.7 C3.1

### Text on the board
tPlace: M4-SHIM | Rev 1
bPlace: Copyright (c) 2020 / Silicognition LLC